# Altium project Callisto Control Board.PrjPcb
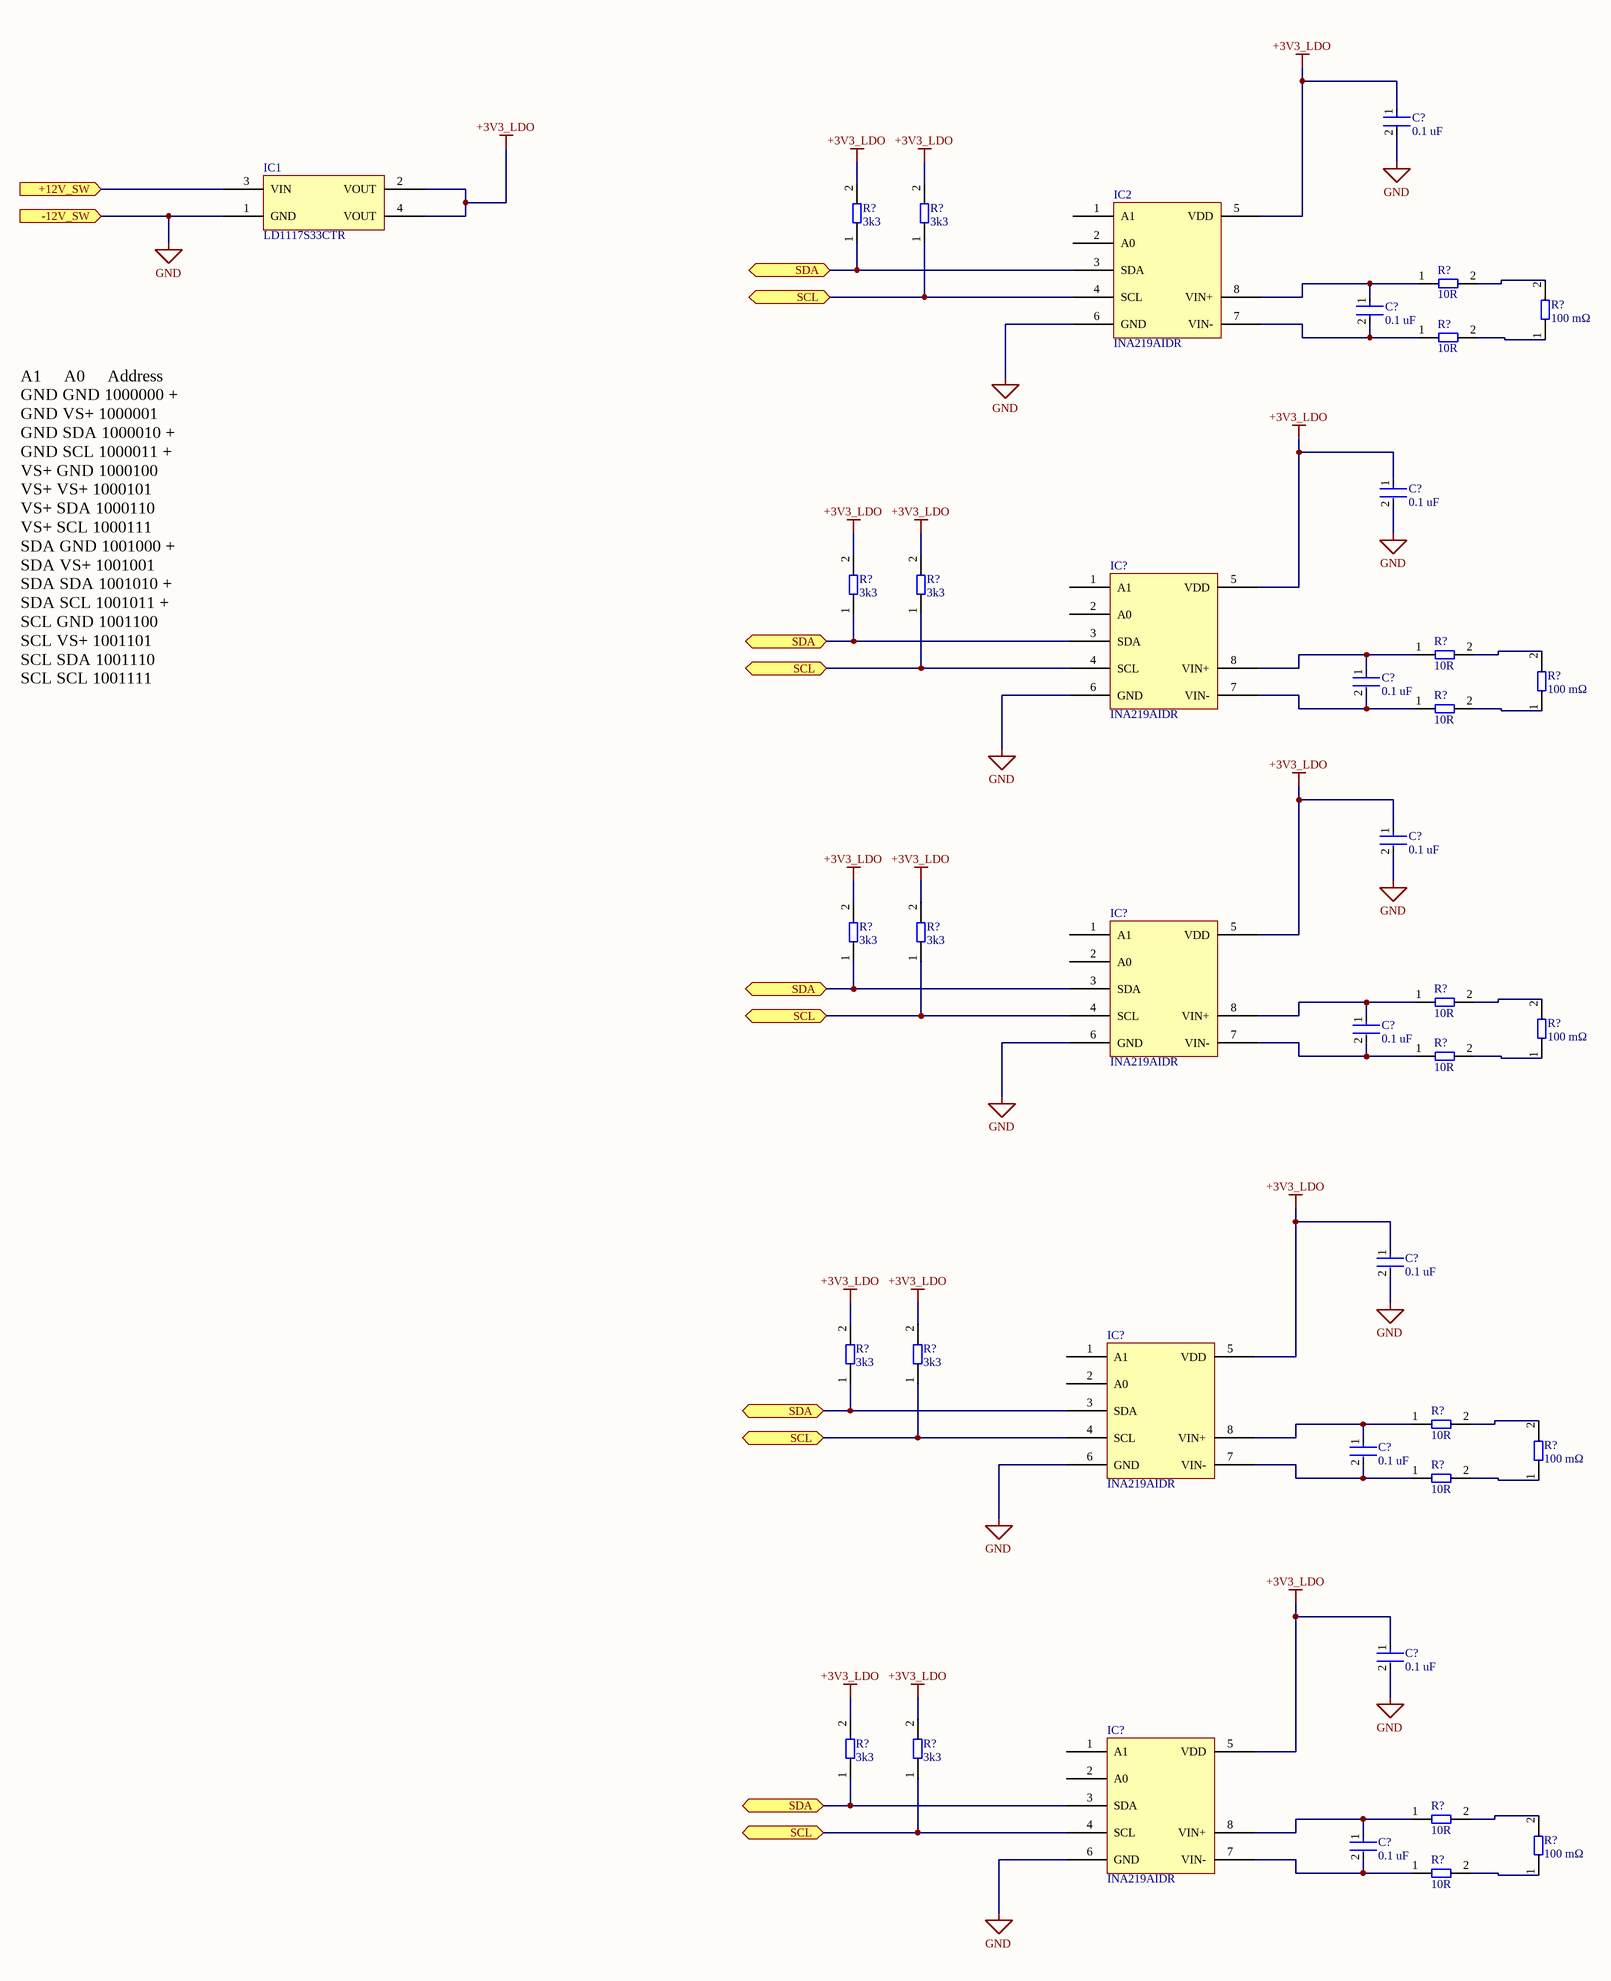
[diagram p0: Pi Sensor Board.SchDoc]
3 sheets, 51 parts. Net scope: hierarchical (ports join the sheet entries above them; power ports are global).
Board file: Callisto Control Board.PcbDoc
Sheets:
  Pi Sensor Board.SchDoc
  Callisto Control Board.SchDoc
    DC/DC Converter = 12V SMPS.SchDoc

## Sheet Pi Sensor Board.SchDoc
size A2; SheetNumber: 3; SheetTotal: 3

### Parts
(Parts that share a designator on the sheet are numbered #1, #2 ... from top to bottom, then left to right.)
C5  0.1 uF  [FP-C0805C-DN-MFG]
C6  0.1 uF  [FP-C0805C-DN-MFG]
C?#1  0.1 uF  [FP-C0805C-DN-MFG]
C?#2  0.1 uF  [FP-C0805C-DN-MFG]
C?#3  0.1 uF  [FP-C0805C-DN-MFG]
C?#4  0.1 uF  [FP-C0805C-DN-MFG]
C?#5  0.1 uF  [FP-C0805C-DN-MFG]
C?#6  0.1 uF  [FP-C0805C-DN-MFG]
C?#7  0.1 uF  [FP-C0805C-DN-MFG]
C?#8  0.1 uF  [FP-C0805C-DN-MFG]
IC1  LD1117S33CTR  [LD1117]
IC2  INA219AIDR  [INA219AIDR]
IC?#1  INA219AIDR  [INA219AIDR]
IC?#2  INA219AIDR  [INA219AIDR]
IC?#3  INA219AIDR  [INA219AIDR]
IC?#4  INA219AIDR  [INA219AIDR]
R3  3k3  [0805 Resistor - IPC A]
R4  3k3  [0805 Resistor - IPC A]
R5  10R  [0805 Resistor - IPC A]
R6  100 mΩ  [PE2512FKM070R1L]
R7  10R  [0805 Resistor - IPC A]
R?#1  3k3  [0805 Resistor - IPC A]
R?#2  3k3  [0805 Resistor - IPC A]
R?#3  10R  [0805 Resistor - IPC A]
R?#4  100 mΩ  [PE2512FKM070R1L]
R?#5  10R  [0805 Resistor - IPC A]
R?#6  3k3  [0805 Resistor - IPC A]
R?#7  3k3  [0805 Resistor - IPC A]
R?#8  10R  [0805 Resistor - IPC A]
R?#9  100 mΩ  [PE2512FKM070R1L]
R?#10  10R  [0805 Resistor - IPC A]
R?#11  3k3  [0805 Resistor - IPC A]
R?#12  3k3  [0805 Resistor - IPC A]
R?#13  10R  [0805 Resistor - IPC A]
R?#14  100 mΩ  [PE2512FKM070R1L]
R?#15  10R  [0805 Resistor - IPC A]
R?#16  3k3  [0805 Resistor - IPC A]
R?#17  3k3  [0805 Resistor - IPC A]
R?#18  10R  [0805 Resistor - IPC A]
R?#19  100 mΩ  [PE2512FKM070R1L]
R?#20  10R  [0805 Resistor - IPC A]

### Ports
+12V_SW (in, see Callisto Control Board[2B], 12V SMPS[8B]), -12V_SW (in, see Callisto Control Board[2B], 12V SMPS[8C]), SCL (bidir, see Callisto Control Board[3B]), SDA (bidir, see Callisto Control Board[3B])

### Nets
+3V3_LDO: C5.1 C?#1.1 C?#3.1 C?#5.1 C?#7.1 IC1.2(VOUT) IC1.4(VOUT) IC2.5(VDD) IC?#1.5(VDD) IC?#2.5(VDD) IC?#3.5(VDD) IC?#4.5(VDD) R3.2 R4.2 R?#1.2 R?#2.2 R?#6.2 R?#7.2 R?#11.2 R?#12.2 R?#16.2 R?#17.2
GND: C5.2 C?#1.2 C?#3.2 C?#5.2 C?#7.2 IC1.1(GND) IC2.6(GND) IC?#1.6(GND) IC?#2.6(GND) IC?#3.6(GND) IC?#4.6(GND) ; port -12V_SW
NetC6_1: C6.1 IC2.8(VIN+) R5.1
NetC6_2: C6.2 IC2.7(VIN-) R7.1
NetC?#2_1: C?#2.1 IC?#1.8(VIN+) R?#3.1
NetC?#2_2: C?#2.2 IC?#1.7(VIN-) R?#5.1
NetC?#4_1: C?#4.1 IC?#2.8(VIN+) R?#8.1
NetC?#4_2: C?#4.2 IC?#2.7(VIN-) R?#10.1
NetC?#6_1: C?#6.1 IC?#3.8(VIN+) R?#13.1
NetC?#6_2: C?#6.2 IC?#3.7(VIN-) R?#15.1
NetC?#8_1: C?#8.1 IC?#4.8(VIN+) R?#18.1
NetC?#8_2: C?#8.2 IC?#4.7(VIN-) R?#20.1
NetIC1_3: IC1.3(VIN) ; port +12V_SW
NetIC2_3: IC2.3(SDA) IC?#1.3(SDA) IC?#2.3(SDA) IC?#3.3(SDA) IC?#4.3(SDA) R3.1 R?#1.1 R?#6.1 R?#11.1 R?#16.1 ; port SDA
NetIC2_4: IC2.4(SCL) IC?#1.4(SCL) IC?#2.4(SCL) IC?#3.4(SCL) IC?#4.4(SCL) R4.1 R?#2.1 R?#7.1 R?#12.1 R?#17.1 ; port SCL
NetR5_2: R5.2 R6.2
NetR6_1: R6.1 R7.2
NetR?#3_2: R?#3.2 R?#4.2
NetR?#4_1: R?#4.1 R?#5.2
NetR?#8_2: R?#8.2 R?#9.2
NetR?#9_1: R?#9.1 R?#10.2
NetR?#13_2: R?#13.2 R?#14.2
NetR?#14_1: R?#14.1 R?#15.2
NetR?#18_2: R?#18.2 R?#19.2
NetR?#19_1: R?#19.1 R?#20.2

Not connected (* = marked no-connect by the designer): IC2 1(A1) 2(A0); IC?#1 1(A1) 2(A0); IC?#2 1(A1) 2(A0); IC?#3 1(A1) 2(A0); IC?#4 1(A1) 2(A0)

### Notes on the sheet
- A1     A0     Address
  GND GND 1000000 +
  GND VS+ 1000001
  GND SDA 1000010 +
  GND SCL 1000011 +
  VS+ GND 1000100
  VS+ VS+ 1000101
  VS+ SDA 1000110
  VS+ SCL 1000111
  SDA GND 1001000 +
  SDA VS+ 1001001
  SDA SDA 1001010 +
  SDA SCL 1001011 +
  SCL GND 1001100
  SCL VS+ 1001101
  SCL SDA 1001110
  SCL SCL 1001111

### Library data of the parts
C5 C6 C?#1-C?#8 = CMP-03020-002581-2: C0805 0.10 μF X7R 30ppm/°C 20.00% 50 V C0805C104M5RAC; Manufacturer: KEMET; Capacitance: 0.10 μF; Voltage Rating: 50 V; Value: 0.10 μF; Tolerance: 0.2; Material: Ceramic; Category: Cap; Temperature: -55°C to +125°C; Lead Free: Yes; Device Class L3: Ceramic Capacitors; Package: C0805C-DN; Height: 0.88mm; Temperature Range High: +125°C; Device Class L2: Capacitors; Manufacturer Part Number: C0805C104M5RAC; Device Class L1: Passive Components; Temperature Coefficient: 30ppm/°C; ComponentLink2Description: Datasheet; RoHS: TRUE; Temperature Range Low: -55°C; ComponentLink2URL: https://content.kemet.com/datasheets/KEM_C1003_C0G_SMD.pdf; Temperature Characteristic: X7R; Mouser Description: Multilayer Ceramic Capacitors MLCC - SMD/SMT 50volts 0.1uF 20% X7R; Octopart: https://octopart.com/c0805c104m5rac-kemet-2226142; Ipc Land Pattern Name: CAPC200125X78; Automotive: No
IC1 = LD1117S33CTR: IC REG LINEAR 3.3V 800MA SOT223
IC2 IC?#1-IC?#4 = INA219AIDR: Current & Power Monitors & Regulators Zero-Drift,Bi-Dir Crnt/Pwr Monitor
R3 R4 R?#1 R?#2 R?#6 R?#7 R?#11 R?#12 R?#16 R?#17 = RE0805FRE073K3L: Thick Film Resistors - SMD 3.3 kOhms 125 mW 0805 1%
R5 R7 R?#3 R?#5 R?#8 R?#10 R?#13 R?#15 R?#18 R?#20 = RC0805FR-0710RL: Thick Film Resistors - SMD 10 Ohms 125 mW 0805 1%
R6 R?#4 R?#9 R?#14 R?#19 = PE2512FKM070R1L: Current Sense Resistors - SMD 100 mOhms 1 Watt 1 % 75 ppm/C AEC-Q200

## Sheet Callisto Control Board.SchDoc
size A3; SheetNumber: 1; SheetTotal: 10
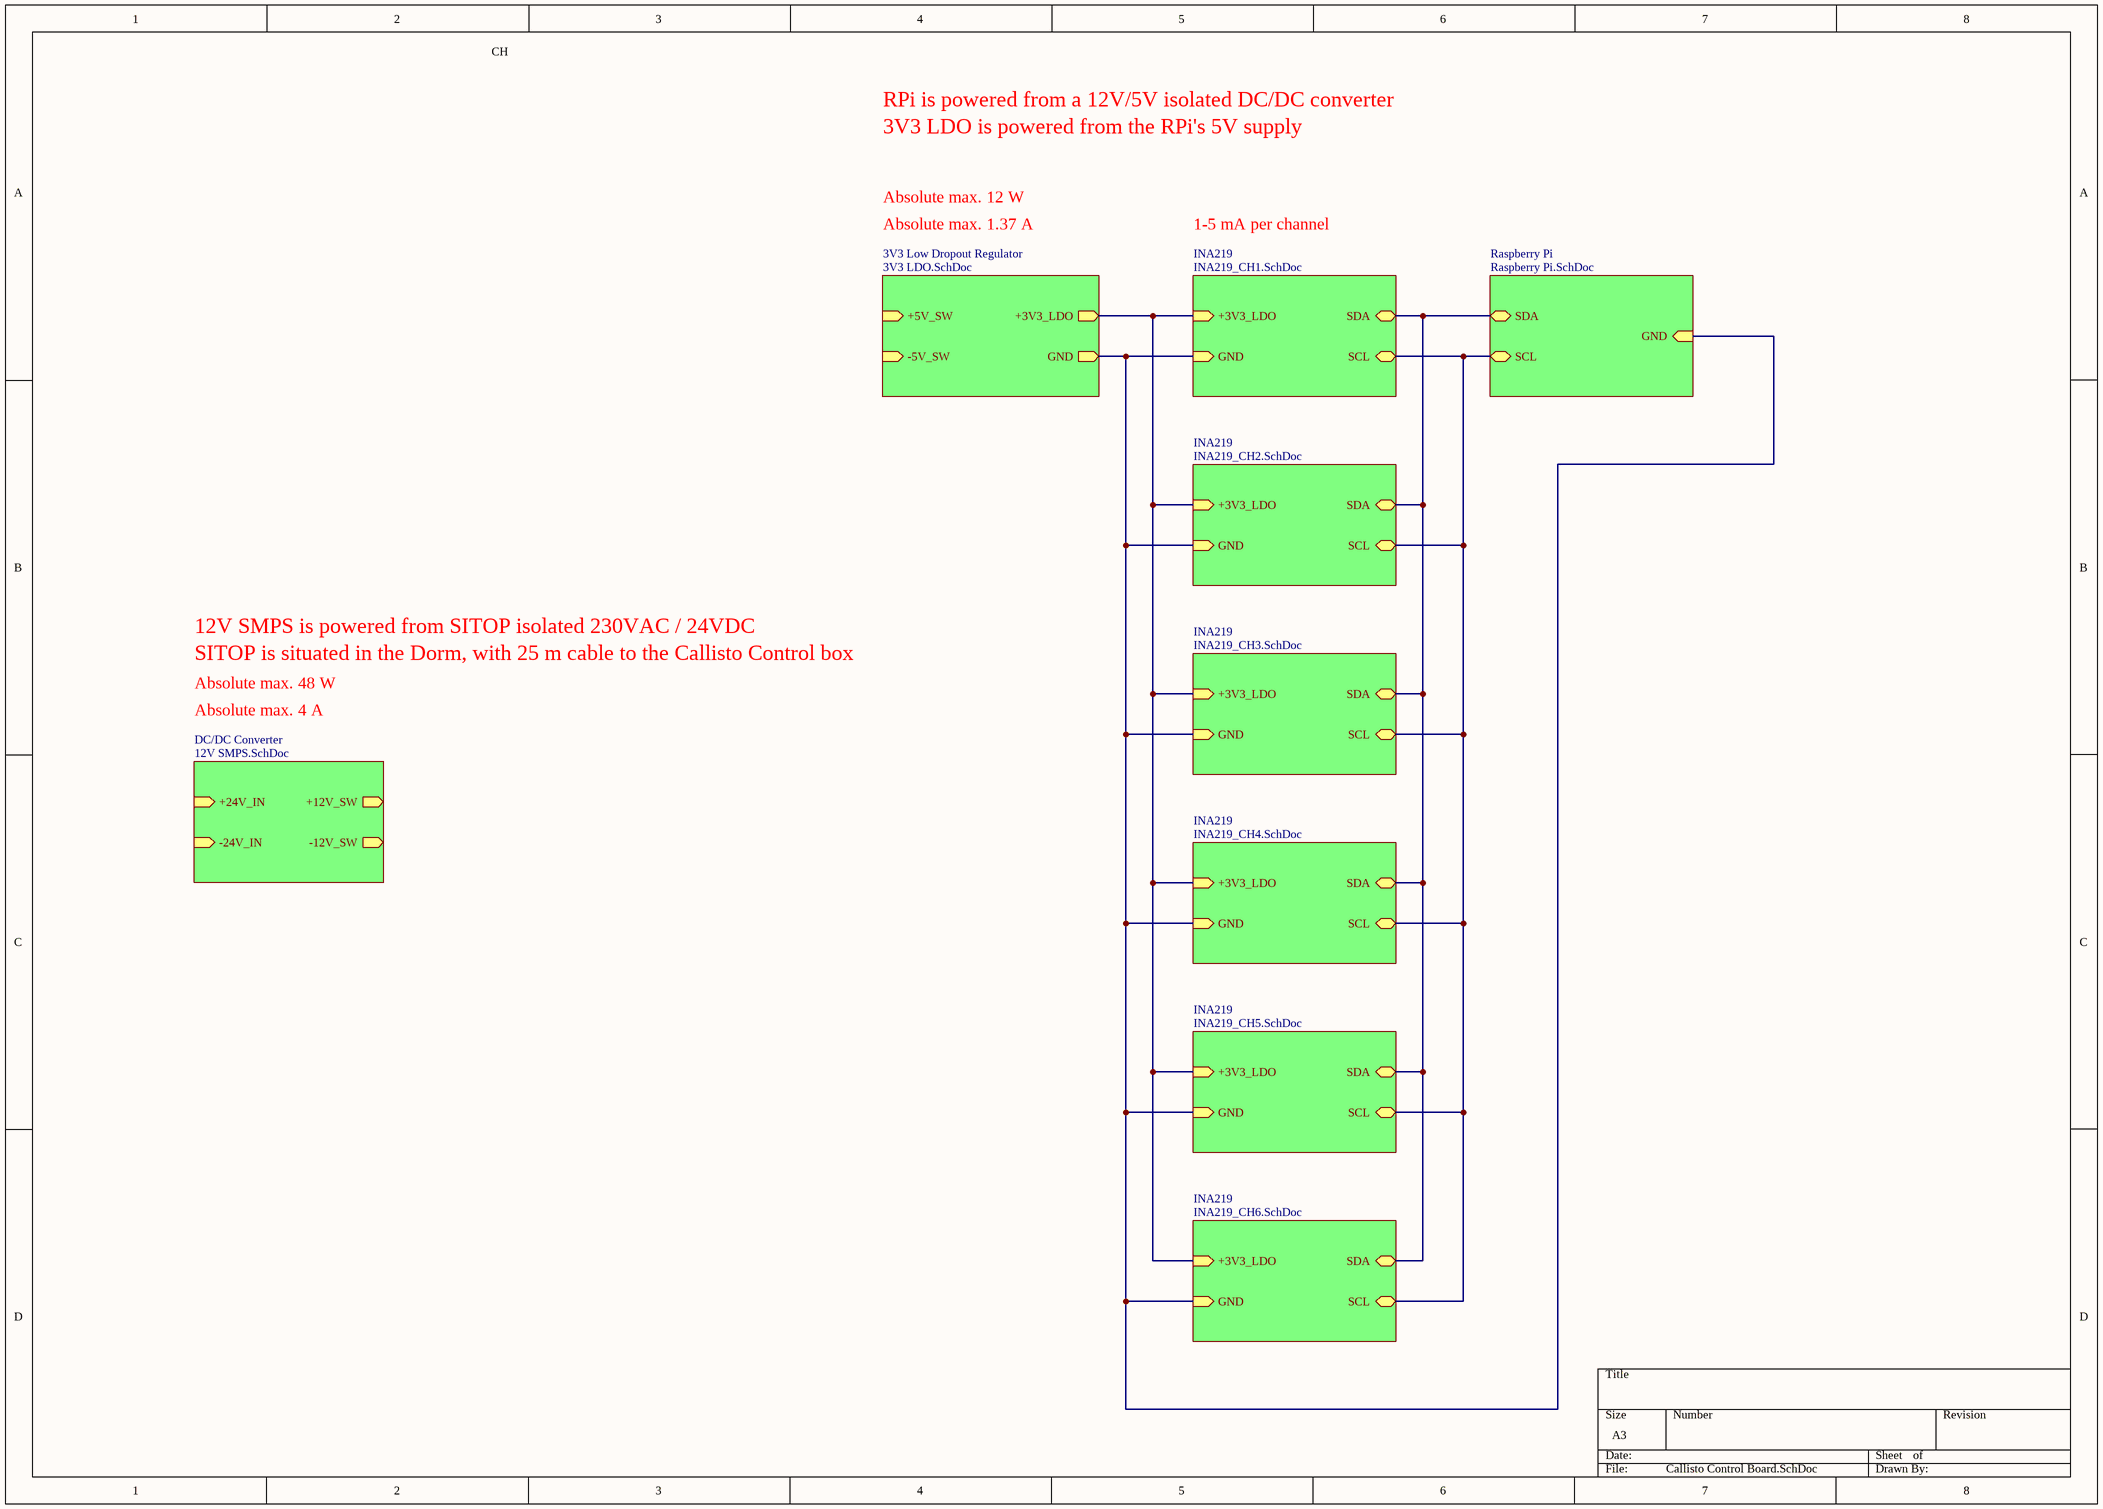
[diagram p1: Callisto Control Board.SchDoc]

### Sub-sheets
3V3 Low Dropout Regulator = 3V3 LDO.SchDoc (file not in this document): +3V3_LDO (out), GND (out), +5V_SW (in), -5V_SW (in)
DC/DC Converter = 12V SMPS.SchDoc: +24V_IN (in), -24V_IN (in), +12V_SW (out), -12V_SW (out)
INA219 = INA219_CH1.SchDoc (file not in this document): SDA (bidir), SCL (bidir), +3V3_LDO (in), GND (in)
INA219 = INA219_CH2.SchDoc (file not in this document): SDA (bidir), SCL (bidir), +3V3_LDO (in), GND (in)
INA219 = INA219_CH3.SchDoc (file not in this document): SDA (bidir), SCL (bidir), +3V3_LDO (in), GND (in)
INA219 = INA219_CH4.SchDoc (file not in this document): SDA (bidir), SCL (bidir), +3V3_LDO (in), GND (in)
INA219 = INA219_CH5.SchDoc (file not in this document): SDA (bidir), SCL (bidir), +3V3_LDO (in), GND (in)
INA219 = INA219_CH6.SchDoc (file not in this document): SDA (bidir), SCL (bidir), +3V3_LDO (in), GND (in)
Raspberry Pi = Raspberry Pi.SchDoc (file not in this document): SDA (bidir), SCL (bidir), GND (in)

### Nets
GND: sheet DC/DC Converter/-24V_IN, sheet DC/DC Converter/-12V_SW
(unnamed): sheet INA219/SDA, sheet INA219/SDA, sheet INA219/SDA, sheet INA219/SDA, sheet INA219/SDA, sheet INA219/SDA, sheet Raspberry Pi/SDA
(unnamed): sheet INA219/SCL, sheet INA219/SCL, sheet INA219/SCL, sheet INA219/SCL, sheet INA219/SCL, sheet INA219/SCL, sheet Raspberry Pi/SCL
(unnamed): sheet INA219/+3V3_LDO, sheet 3V3 Low Dropout Regulator/+3V3_LDO, sheet INA219/+3V3_LDO, sheet INA219/+3V3_LDO, sheet INA219/+3V3_LDO, sheet INA219/+3V3_LDO, sheet INA219/+3V3_LDO
(unnamed): sheet INA219/GND, sheet 3V3 Low Dropout Regulator/GND, sheet INA219/GND, sheet INA219/GND, sheet INA219/GND, sheet INA219/GND, sheet INA219/GND, sheet Raspberry Pi/GND

### Notes on the sheet
- CH
- RPi is powered from a 12V/5V isolated DC/DC converter
- 3V3 LDO is powered from the RPi's 5V supply
- Absolute max. 12 W
- Absolute max. 1.37 A
- 1-5 mA per channel
- 12V SMPS is powered from SITOP isolated 230VAC / 24VDC
- Absolute max. 48 W
- Absolute max. 4 A
- SITOP is situated in the Dorm, with 25 m cable to the Callisto Control box

## Sheet 12V SMPS.SchDoc
size A3; SheetNumber: 2; SheetTotal: 3
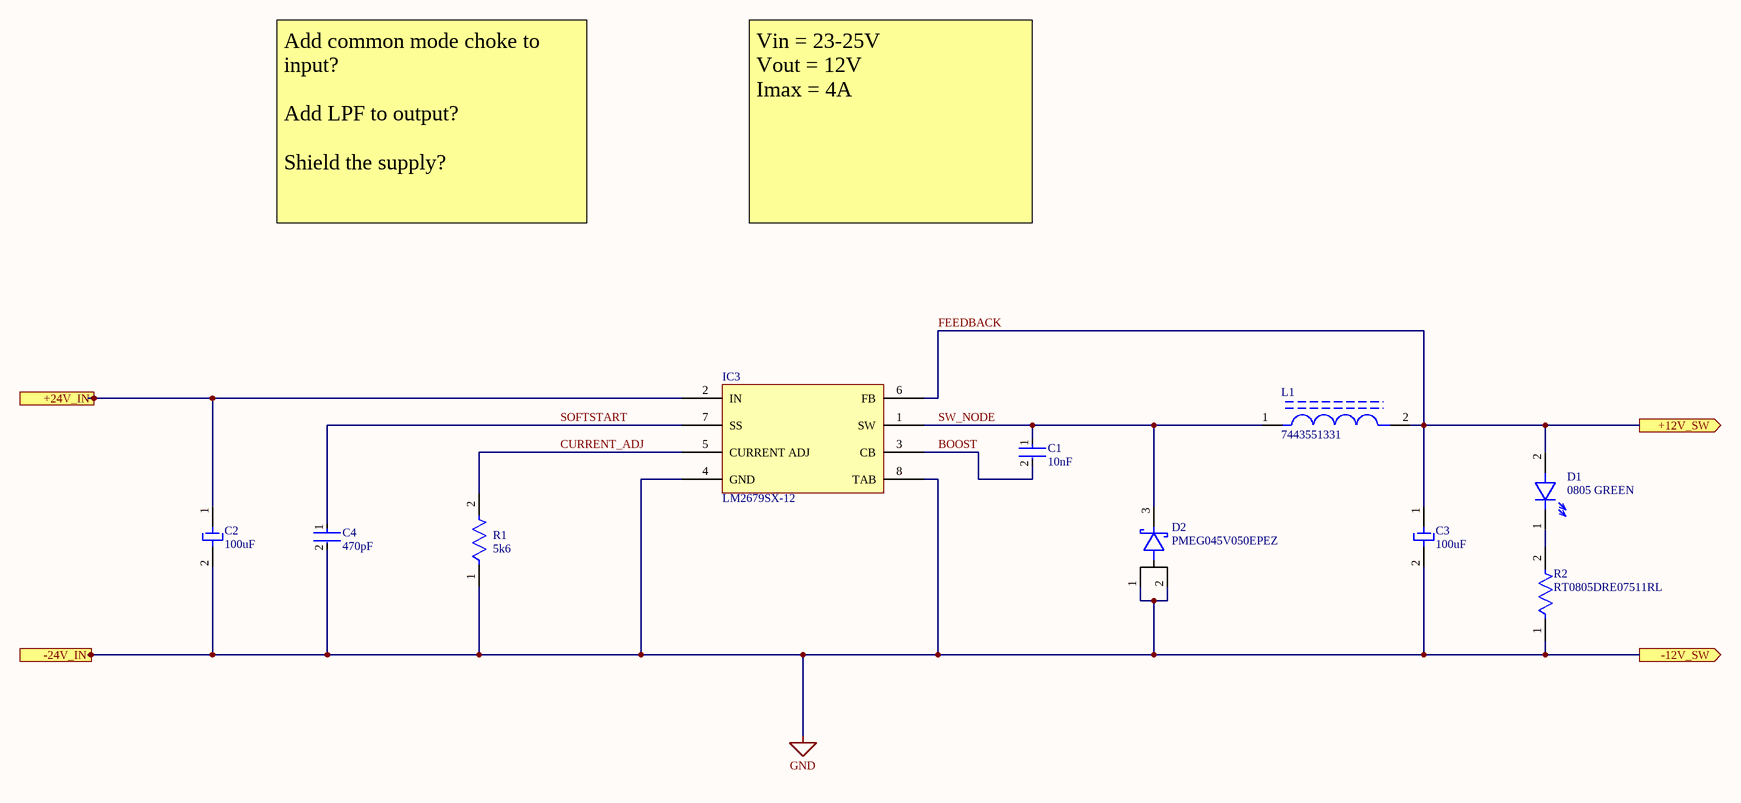
[diagram p2: 12V SMPS.SchDoc]

### Parts
C1  10nF  [FP-C0805C-DN-MFG]
C2  100uF  [AHA1010101M040R]
C3  100uF  [AHA1010101M040R]
C4  470pF  [FP-C0805C-DN-MFG]
D1  0805 GREEN  [0805 LED]
D2  PMEG045V050EPEZ  [PMEG045V050EPE]
IC3  LM2679SX-12  [TS7B_M]
L1  7443551331  [7443551331 33uH]
R1  5k6  [FP-CRCW0805-e3-IPC_A]
R2  RT0805DRE07511RL  [FP-RT0805-MFG]

### Ports
+12V_SW (out, see Callisto Control Board[2B], Pi Sensor Board[1A]), +24V_IN (in, see Callisto Control Board[1B]), -12V_SW (out, see Callisto Control Board[2B], Pi Sensor Board[1A]), -24V_IN (in, see Callisto Control Board[1B])

### Nets
GND: C2.2 C3.2 C4.2 D2.1(Anode) D2.2(Anode) IC3.4(GND) IC3.8(TAB) R1.1 R2.1 ; port -24V_IN, port -12V_SW
BOOST: C1.2 IC3.3(CB)
CURRENT_ADJ: IC3.5(CURRENT_ADJ) R1.2
FEEDBACK: C3.1 D1.2(Anode) IC3.6(FB) L1.2 ; port +12V_SW
SOFTSTART: C4.1 IC3.7(SS)
SW_NODE: C1.1 D2.3(Cathode) IC3.1(SW) L1.1
NetC2_1: C2.1 IC3.2(IN) ; port +24V_IN
NetD1_1: D1.1(Cathode) R2.2

### Notes on the sheet
- Add common mode choke to input?
  Add LPF to output?
  Shield the supply?
- Vin = 23-25V
  Vout = 12V
  Imax = 4A

### Library data of the parts
C1 = CMP-03020-003256-1: C0805 10,000 pF C0G 30ppm/°C 5.00% 50 V; Manufacturer: KEMET; Manufacturer Part Number: C0805C103J5GAC; Voltage Rating: 50 V; Material: Ceramic; Tolerance: 0.05; RoHS: TRUE; Value: 10,000 pF; Package: C0805C-DN; Automotive: No; Device Class L2: Capacitors; Device Class L1: Passive Components; Lead Free: Yes; Octopart: https://octopart.com/c0805c103j5gac-kemet-22233108; Mouser Description: Multilayer Ceramic Capacitors MLCC - SMD/SMT 50volts 0.01uF 5% C0G; Ipc Land Pattern Name: CAPC200125X78; Temperature Range Low: -55°C; Temperature Coefficient: 30ppm/°C; Temperature: -55°C to +125°C; ComponentLink2Description: Datasheet; ComponentLink2URL: https://content.kemet.com/datasheets/KEM_C1003_C0G_SMD.pdf; Height: 0.88mm; Temperature Range High: +125°C; Category: Cap; Temperature Characteristic: C0G; Device Class L3: Ceramic Capacitors; Capacitance: 10,000 pF
C2 C3 = 100uF: Kyocera AHA1010101M040R
C4 = CMP-03020-010584-1: C0805 470 pF C0G 30ppm/°C 5.00% 50 V; Manufacturer: KEMET; Manufacturer Part Number: C0805C471J5GAC; Material: Ceramic; Tolerance: 0.05; Voltage Rating: 50 V; Temperature: -55°C to +125°C; Ipc Land Pattern Name: CAPC200125X78; Automotive: No; Value: 470 pF; Capacitance: 470 pF; Temperature Range High: +125°C; Category: Cap; Lead Free: Yes; RoHS: TRUE; ComponentLink2Description: Datasheet; Temperature Coefficient: 30ppm/°C; Package: C0805C-DN; Height: 0.88mm; ComponentLink2URL: https://content.kemet.com/datasheets/KEM_C1003_C0G_SMD.pdf; Temperature Range Low: -55°C; Mouser Description: Multilayer Ceramic Capacitors MLCC - SMD/SMT 50volts 470pF 5% C0G; Temperature Characteristic: C0G; Device Class L1: Passive Components; Octopart: https://octopart.com/c0805c471j5gac-kemet-1364888; Device Class L3: Ceramic Capacitors; Device Class L2: Capacitors
D1 = 0805 LED: Wurth Electronics 150080VS75000
IC3 = LM2679SX-12: LM2679SX-12/NOPB
L1 = 7443551331: Wurth Electronics 7443551331
R1 = CMP-2001-04030-2: RES Thick Film, 5.6kΩ, 1%, 0.125W, 100ppm/°C, 0805; Resistance: 5.6kR; Voltage Rating: 150V; Max Power Dissipation: 125mW; Case Code (Imperial): 0805; Features: Automotive AEC-Q200; Composition: Thick Film; Package Quantity: 1; Mount: Surface Mount; Tolerance: 1%; Radiation Hardening: No; Length: 2mm; Case Code (Metric): 2012; Temperature Coefficient: 100ppm/°C; Power Rating: 125mW; Number of Terminations: 2; Lead Free: Lead Free; Voltage Rating (DC): 150V; Military Standard: Not; Number of Pins: 2; Height: 0.45mm; Depth: 1.25mm; Weight: 0.000194oz; Packaging: Tape and Reel; Case/Package: 0805; Contact Plating: Tin; Min Operating Temperature: -55°C; Termination: SMD/SMT; Max Operating Temperature: 155°C; Width: 1.25mm
R2 = CMP-03412-001492-1: RES SMD 511 OHM 0.5% 1/8W 0805; Manufacturer: Yageo; Voltage Rating: 150V; Power Rating: 0.125W; Value: 511Ω; Tolerance: 0.01; Temperature Coefficient: 50 ppm/°C; Ipc Land Pattern Name: RESC200125X50; Lead Free: Yes; Device Class L2: Resistors; Digikey Description: RES SMD 511 OHM 0.5% 1/8W 0805; Device Class L1: Passive Components; RoHS: TRUE; ComponentLink2Description: Datasheet; Temperature Range Low: -55°C; Temperature Range High: +155°C; Composition: Thin Film; Package: RT0805; Height: 0.6mm; ComponentLink2URL: http://www.yageo.com/documents/recent/PYu-RT_1-to-0.01_RoHS_L_9.pdf; Manufacturer Part Number: RT0805DRE07511RL; Temperature: -55°C to +155°C; Footprint Url: http://www.yageo.com/exep/pages/download/literatures/PYu-R_Mount_10.pdf; Series: RT; Device Class L3: Chip SMD Resistors; Resistance: 511Ω; Octopart: https://octopart.com/rt0805dre07511rl-yageo-1369364; Automotive: No; Category: Res

## Nets that join several sheets
GND: Pi Sensor Board (11 pins), 12V SMPS (9 pins)